# Altium schematic sheet stm32f373-relay-control.SchDoc: stm32f373-relay-control
size A4; Engineer: M.GUENI; Revision: R0; SheetNumber: 1; SheetTotal: 8
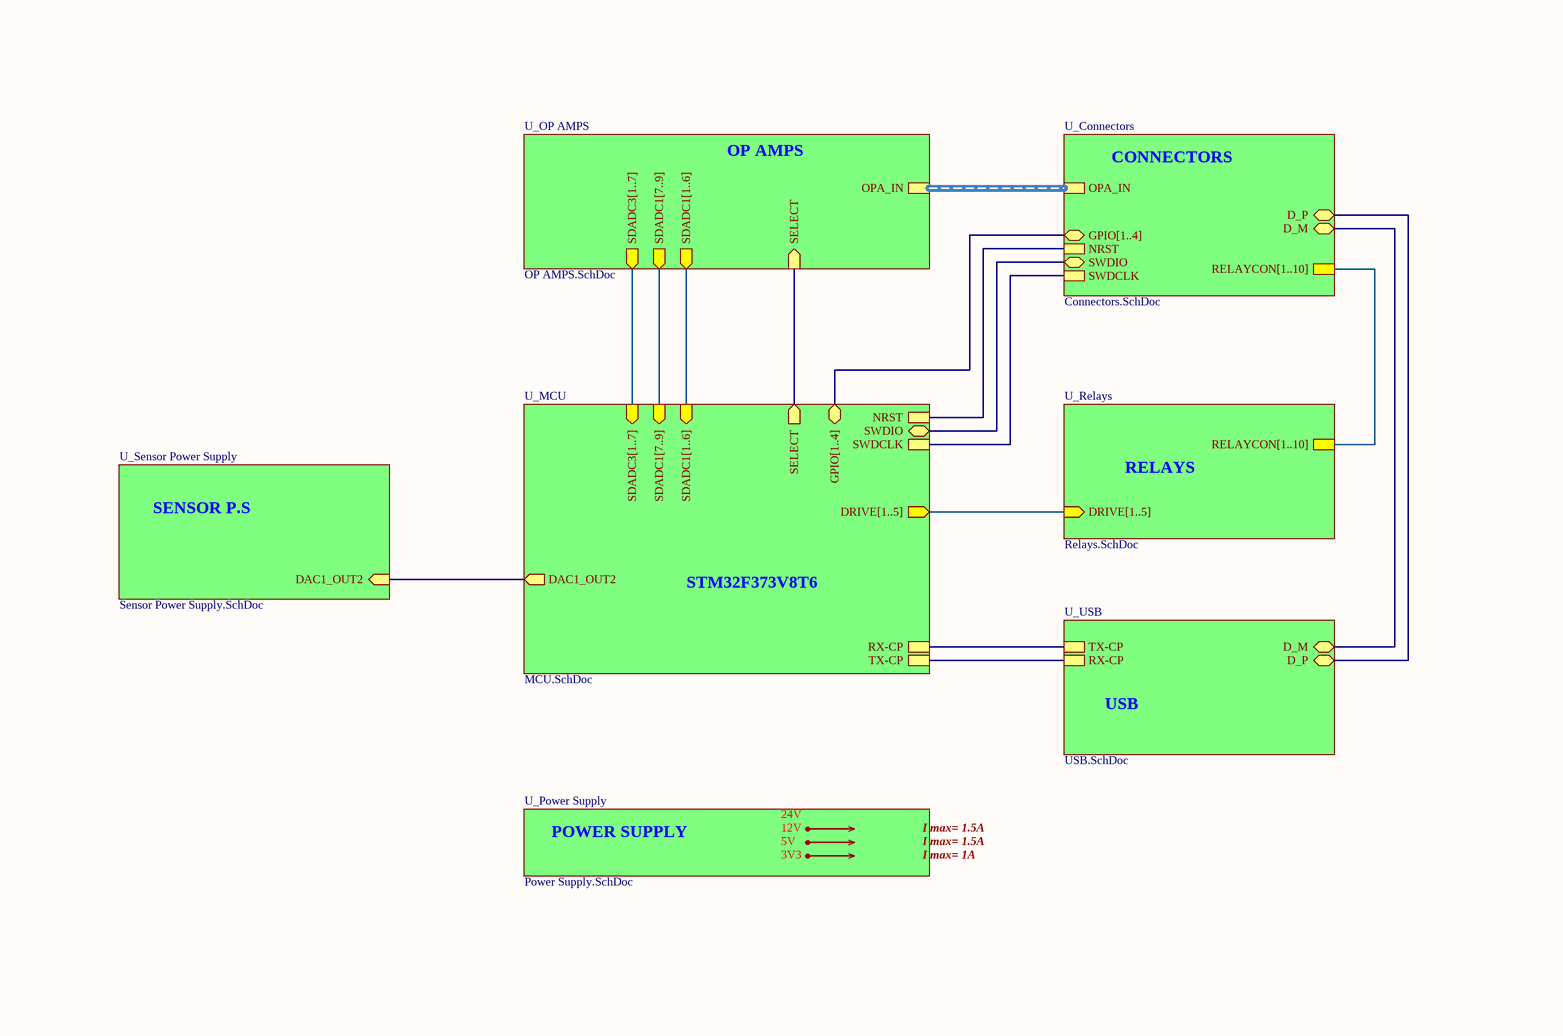
[diagram p0: stm32f373-relay-control.SchDoc]

## Sub-sheets
U_Connectors = Connectors.SchDoc: RELAYCON[1..10], OPA_IN (harness OPA_IN), D_P (bidir), D_M (bidir), SWDIO (bidir), SWDCLK, NRST, GPIO[1..4] (bidir)
U_MCU = MCU.SchDoc: SDADC3[1..7] (in), SDADC1[1..6] (in), SDADC1[7..9] (in), DAC1_OUT2 (out), SELECT (out), DRIVE[1..5] (out), RX-CP, TX-CP, SWDIO (bidir), SWDCLK, NRST, GPIO[1..4] (bidir)
U_OP AMPS = OP AMPS.SchDoc: SDADC1[1..6] (out), SDADC1[7..9] (out), SDADC3[1..7] (out), OPA_IN (harness OPA_IN), SELECT (in)
U_Power Supply = Power Supply.SchDoc: no entries
U_Relays = Relays.SchDoc: RELAYCON[1..10], DRIVE[1..5] (in)
U_Sensor Power Supply = Sensor Power Supply.SchDoc: DAC1_OUT2 (in)
U_USB = USB.SchDoc: TX-CP, RX-CP, D_M (bidir), D_P (bidir)

## Nets
(unnamed): sheet U_Connectors/D_P, sheet U_USB/D_P
(unnamed): sheet U_Connectors/D_M, sheet U_USB/D_M
(unnamed): sheet U_Connectors/SWDIO, sheet U_MCU/SWDIO
(unnamed): sheet U_Connectors/SWDCLK, sheet U_MCU/SWDCLK
(unnamed): sheet U_Connectors/NRST, sheet U_MCU/NRST
(unnamed): sheet U_OP AMPS/SELECT, sheet U_MCU/SELECT
(unnamed): sheet U_Sensor Power Supply/DAC1_OUT2, sheet U_MCU/DAC1_OUT2
(unnamed): sheet U_USB/TX-CP, sheet U_MCU/RX-CP
(unnamed): sheet U_USB/RX-CP, sheet U_MCU/TX-CP

## Buses and harness runs
bus sheet U_Connectors/GPIO[1..4] = sheet U_MCU/GPIO[1..4]
bus sheet U_Connectors/RELAYCON[1..10] = sheet U_Relays/RELAYCON[1..10]
bus sheet U_MCU/DRIVE[1..5] = sheet U_Relays/DRIVE[1..5]
bus sheet U_MCU/SDADC1[1..6] = sheet U_OP AMPS/SDADC1[1..6]
bus sheet U_MCU/SDADC1[7..9] = sheet U_OP AMPS/SDADC1[7..9]
bus sheet U_MCU/SDADC3[1..7] = sheet U_OP AMPS/SDADC3[1..7]
harness sheet U_Connectors/OPA_IN = sheet U_OP AMPS/OPA_IN

## Notes on the sheet
- OP AMPS
- CONNECTORS
- SENSOR P.S
- RELAYS
- STM32F373V8T6
- USB
- POWER SUPPLY
- 12V
- 5V
- 24V
- I max= 1.5A
- 3V3
- I max= 1A
- THIS DOCUMENT AND THE DATA DISCLOSED HEREIN OR
- HEREWITH IS THE PROPERTY OF ALTIUM LIMITED AND MAY
- DWG NO:
- REVISION
- REV:
- DESCRIPTION
- DATE
- APPROVED
- BE FREELY DISTRIBUTED IN WHOLE. NO RIGHTS ARE
- RESERVED OR EXPRESS OR IMPLIED WARANTEE GIVEN.
- ENG:
- APPROVALS
- PROJECT
- DSN:
- CHK:
- REFERENCE DOCUMENTS
- PROJECT REVISION:
- TITLE
- DOCUMENT REVISION:
- DESIGN ITEM:
- BOM:
- FAB DWG:
- PCB DWG:
- ASSY DWG:
- SCALE:
- A3
- SIZE
- CAGE CODE
- FILE NAME
- DWG NO.
- SHEET
- OF
- REV